# EAGLE design tempPCB (EAGLE 9.6.2)
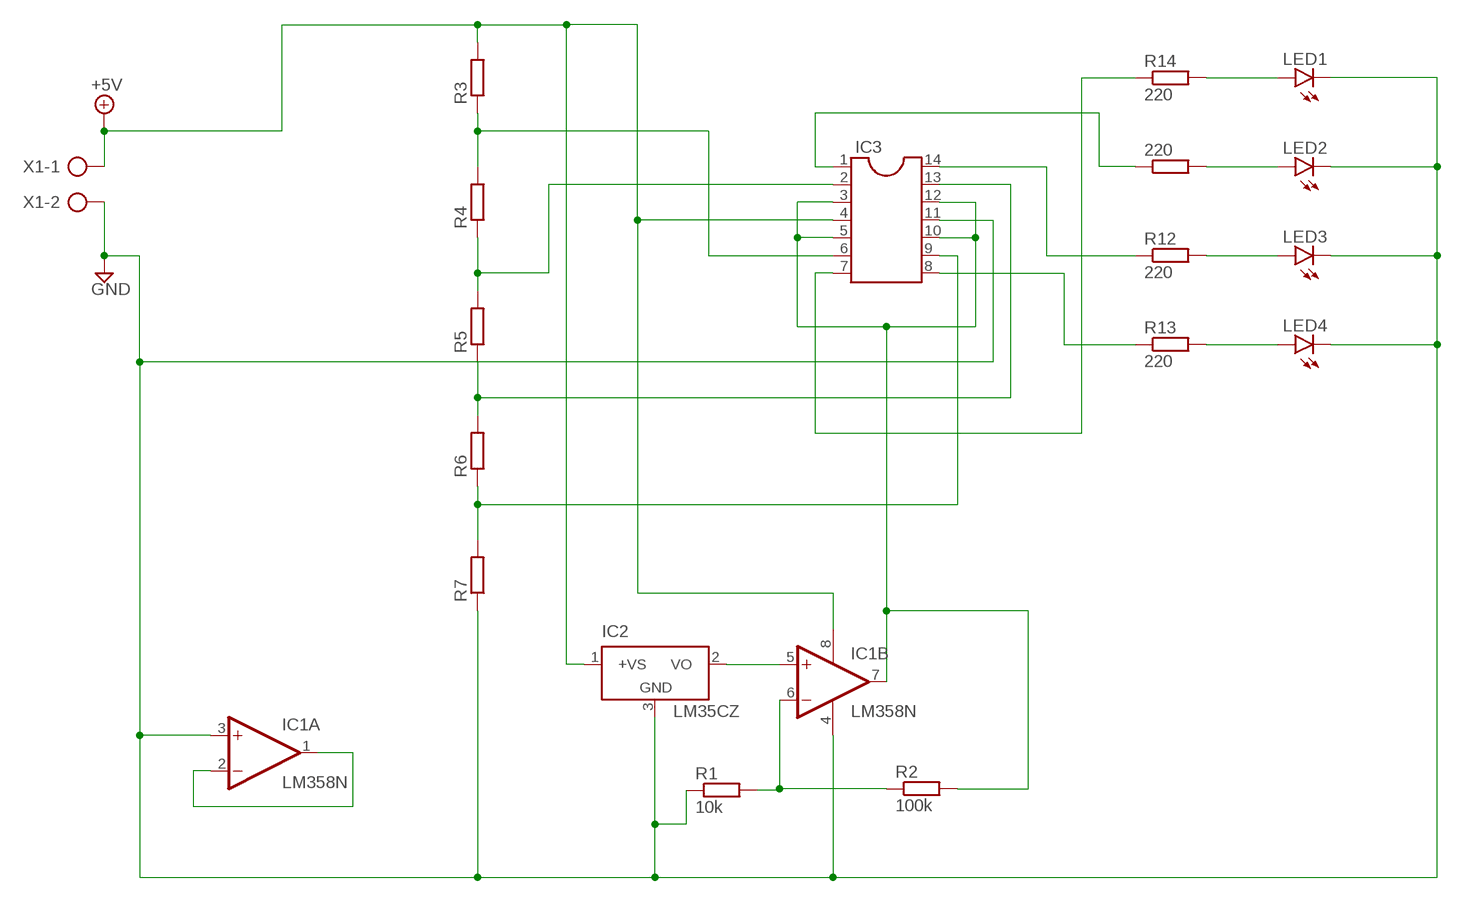
[diagram p0: schematic, sheet 1]

## Parts
220  R-EU_0207/10  [0207/10]
IC1  LM358N  [DIL08]
IC2  LM35CZ  [TO92]
IC3  DIL14  [DIL14]
LED1  LED5MM  [LED5MM]
LED2  LED5MM  [LED5MM]
LED3  LED5MM  [LED5MM]
LED4  LED5MM  [LED5MM]
R1  10k  R-EU_R1206  [R1206]
R2  100k  R-EU_R1206  [R1206]
R3  R-EU_R1206  [R1206]
R4  R-EU_0207/10  [0207/10]
R5  R-EU_R1206  [R1206]
R6  R-EU_0207/10  [0207/10]
R7  R-EU_R1206  [R1206]
R12  220  R-EU_0207/10  [0207/10]
R13  220  R-EU_0207/10  [0207/10]
R14  220  R-EU_0207/10  [0207/10]
X1  AK500/2  [AK500/2]

## Nets
+5V: IC1.8(P:V+) IC2.1(+VS) IC3.4 R3.2 X1.1
GND: IC1.3(A:+IN) IC1.4(P:V-) IC2.3(GND) IC3.11 LED1.K(C) LED2.K(C) LED3.K(C) LED4.K(C) R1.1 R7.1 X1.2
N$1: LED1.A R14.2
N$2: 220.2 LED2.A
N$3: LED3.A R12.2
N$4: LED4.A R13.2
N$5: IC1.1(A:OUT) IC1.2(A:-IN)
N$6: IC3.7 R14.1
N$7: 220.1 IC3.1
N$8: IC3.14 R12.1
N$9: IC3.8 R13.1
N$10: IC3.13 R5.1 R6.2
N$11: IC1.5(B:+IN) IC2.2(VO)
N$12: IC1.6(B:-IN) R1.2 R2.1
N$13: IC1.7(B:OUT) IC3.3 IC3.5 IC3.10 IC3.12 R2.2
N$14: IC3.9 R6.1 R7.2
N$15: IC3.2 R4.1 R5.2
N$20: IC3.6 R3.1 R4.2

## Library data of the parts
220 R1-R7 R12-R14 = rcl:R-EU_: RESISTOR, European symbol; SPICEPREFIX: R
IC1 = linear:LM358: OP AMP also LM158; LM258; LM2904 Source: http://cache.national.com/ds/LM/LM158.pdf
IC2 = lm35:LM35: Single-Supply Centigrade Temperature Sensor Vout = (10mV/°C x Temp °C) +5mmmV Source: http://www.national.com/ds/LM/LM35.pdf
IC3 = ic-package:DIL14: Dual In Line / Socket
LED1-LED4 = led:LED: LED OSRAM: - CHIPLED LG R971, LG N971, LY N971, LG Q971, LY Q971, LO R971, LY R971 LH N974, LH R974 LS Q976, LO Q976, LY Q976 LO Q996 - Hyper CHIPLED LW Q18S LB Q993, LB Q99A, LB R99A - SideLED LS A670, LO A670, LY A670, LG A670, LP A670 LB A673, LV A673, LT A673, LW A673 LH A674 LY A675 LS A676, LA A676, LO A676, LY A676, LW A676 LS A679, LY A679, LG A679 - Hyper Micro SIDELED® LS Y876, LA Y876, LO Y876, LY Y876 LT Y87S - SmartLED LW L88C, LW L88S LB L89C, LB L89S, LG L890 LS L89K, LO L89K, LY L89K LS L896, LA L896, LO L896, LY L896 - TOPLED LS T670, LO T670, LY T670, LG T670, LP T670 LSG T670, LSP T670, LSY T670, LOP T670, LYG T670 LG T671, LOG T671, LSG T671 LB T673, LV T673, LT T673, LW T673 LH T674 LS T676, LA T676, LO T676, LY T676, LB T676, LH T676, LSB T676, LW T676 LB T67C, LV T67C, LT T67C, LS T67K, LO T67K, LY T67K, LW E67C LS E67B, LA E67B, LO E67B, LY E67B, LB E67C, LV E67C, LT E67C LW T67C LS T679, LY T679, LG T679 LS T770, LO T770, LY T770, LG T770, LP T770 LB T773, LV T773, LT T773, LW T773 LH T774 LS E675, LA E675, LY E675, LS T675 LS T776, LA T776, LO T776, LY T776, LB T776 LHGB T686 LT T68C, LB T68C - Hyper Mini TOPLED® LB M676 - Mini TOPLED Santana® LG M470 LS M47K, LO M47K, LY M47K Source: http://www.osram.convergy.de LUXEON: - LUMILED® LXK2-PW12-R00, LXK2-PW12-S00, LXK2-PW14-U00, LXK2-PW14-V00 LXK2-PM12-R00, LXK2-PM12-S00, LXK2-PM14-U00 LXK2-PE12-Q00, LXK2-PE12-R00, LXK2-PE12-S00, LXK2-PE14-T00, LXK2-PE14-U00 LXK2-PB12-K00, LXK2-PB12-L00, LXK2-PB12-M00, LXK2-PB14-N00, LXK2-PB14-P00, LXK2-PB14-Q00 LXK2-PR12-L00, LXK2-PR12-M00, LXK2-PR14-Q00, LXK2-PR14-R00 LXK2-PD12-Q00, LXK2-PD12-R00, LXK2-PD12-S00 LXK2-PH12-R00, LXK2-PH12-S00 LXK2-PL12-P00, LXK2-PL12-Q00, LXK2-PL12-R00 Source: www.luxeon.com KINGBRIGHT: KA-3528ASYC Source: www.kingbright.com
X1 = con-ptr500:AK500/2: CONNECTOR; OC_FARNELL: unknown; OC_NEWARK: unknown

## Board
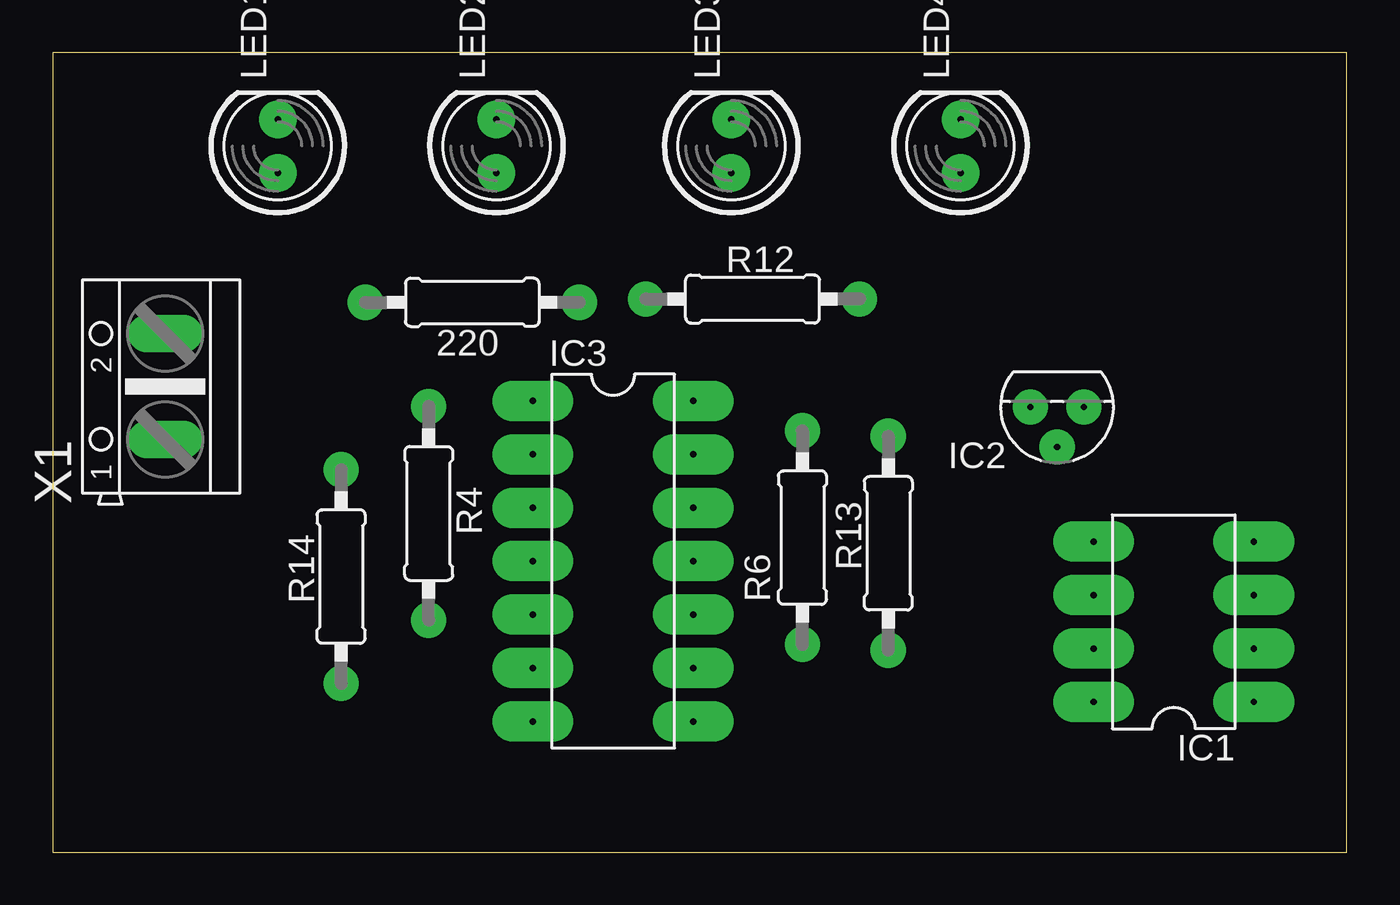
[diagram p1: board, top side]
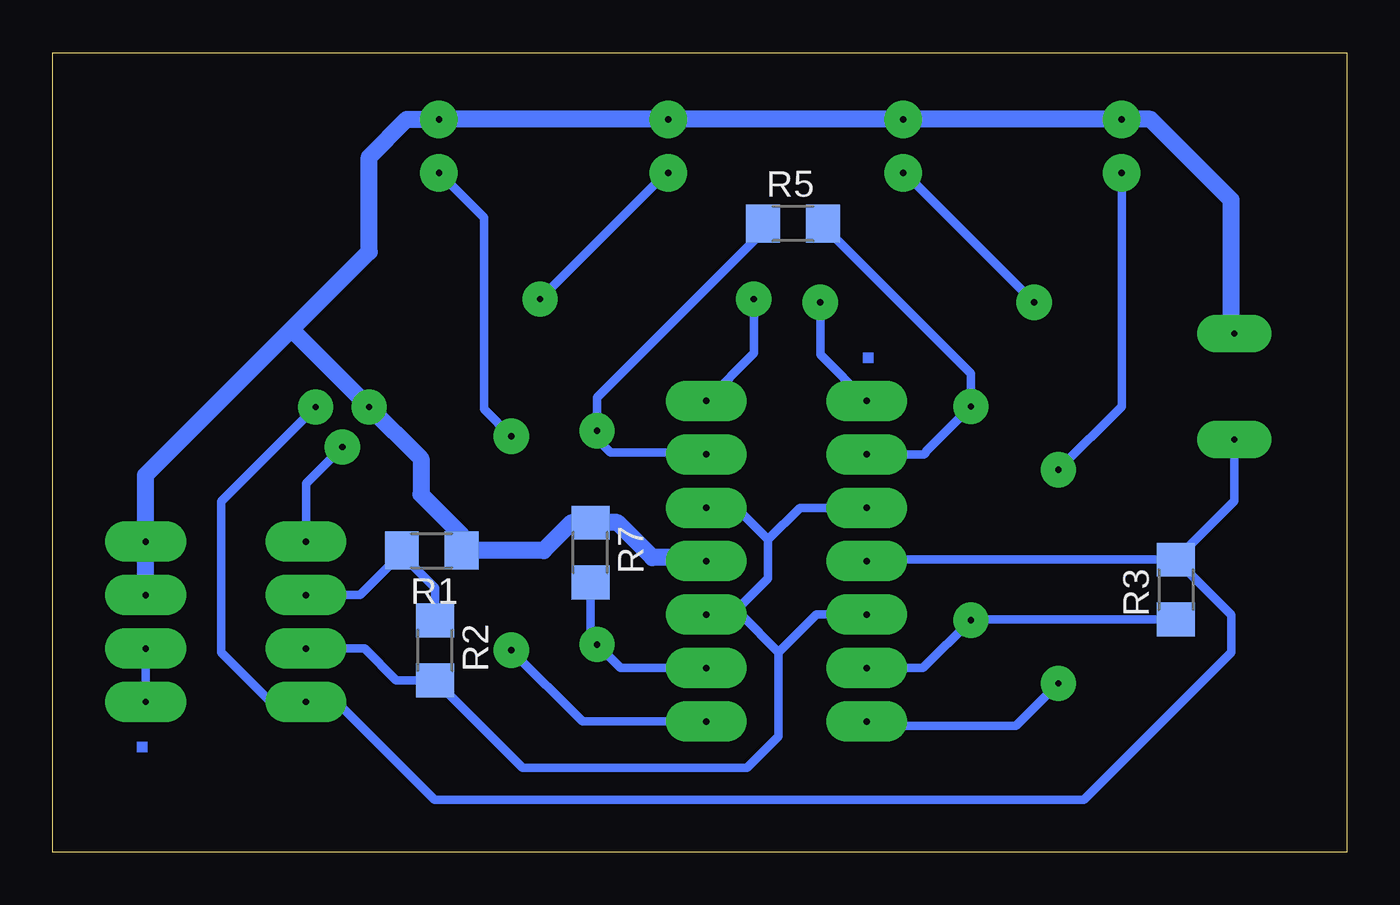
[diagram p2: board, bottom side, seen from below]

Size 61.5 x 38 mm. Coordinates in mm from the lower left corner, seen from the top.
Outline: 0,0 61.5,0 61.5,38 0,38 0,0
Copper layers (1*16): Top 0.035mm / dielectric 1.5mm / Bottom 0.035mm
Design rules "OpenLab": minimum track width 0.4mm, minimum drill 0.6mm, track to track 0.5mm, track to pad 0.5mm, pad to pad 0.5mm, via to via 0.5mm, smd to smd 0.1mm, copper to edge 2mm, drill to drill 0.2mm, minimum pad ring 10mil, minimum via ring 8mil, stop-mask expansion 4mil, vias tented up to drill 0mil, thermal gap 10mil

### Footprints (pad centres in the part's own frame; a part is rotated, then mirrored left to right if it is on the bottom)
0207/10 = drill 0.3 pad 1.676: 1 -5.08,0; 2 5.08,0
DIL08 = drill 0.3 pad 1.93 long: 1 -3.81,-3.81; 2 -1.27,-3.81; 3 1.27,-3.81; 4 3.81,-3.81; 5 3.81,3.81; 6 1.27,3.81; 7 -1.27,3.81; 8 -3.81,3.81
TO92 = drill 0.3 pad 1.676: 1 -1.27,0; 2 0,1.905; 3 1.27,0
DIL14 = drill 0.3 pad 1.93 long: 1 -7.62,-3.81; 2 -5.08,-3.81; 3 -2.54,-3.81; 4 0,-3.81; 5 2.54,-3.81; 6 5.08,-3.81; 7 7.62,-3.81; 8 7.62,3.81; 9 5.08,3.81; 10 2.54,3.81; 11 0,3.81; 12 -2.54,3.81; 13 -5.08,3.81; 14 -7.62,3.81
LED5MM = drill 0.3 pad 1.778: A -1.27,0; K 1.27,0
R1206 = smd 1.6 x 1.803: 1 -1.422,0; 2 1.422,0
AK500/2 = drill 0.3 pad 1.778 long: 1 -2.515,0; 2 2.515,0

### Placement (x,y rotation side)
220  19.94,26.13 180 top
IC1  53.27,10.95 90 top
IC2  47.73,21.16 180 top
IC3  26.63,13.83 270 top
LED1  10.7,33.56 90 top
LED2  21.09,33.56 90 top
LED3  32.25,33.56 90 top
LED4  43.14,33.56 90 top
R1  43.49,14.33 180 bottom
R2  43.33,9.59 270 bottom
R3  8.13,12.48 90 bottom
R4  17.87,16.1 270 top
R5  26.32,29.87 0 bottom
R6  35.63,14.95 90 top
R7  35.95,14.24 270 bottom
R12  33.26,26.29 0 top
R13  39.71,14.68 90 top
R14  13.71,13.1 90 top
X1  5.35,22.13 90 top

### Tracks (layer width: path | path; a pad name or v marks a point on that pad's centre or on a via)
+5V
  Bottom 0.406: R3.2 5.35,16.68 X1.1 | R3.2 22.75,13.9 IC3.4 | IC2.1 53.5,16.66 53.5,9.5 51.14,7.14 IC1.8 48,7.14 43.36,2.5 12.5,2.5 5.5,9.5 5.5,11.27 R3.2
GND
  Bottom 0.813: X1.2 5.5,24.8 5.5,31 9.33,34.83 LED1.K LED2.K LED3.K LED4.K 44.67,34.83 46.46,33.04 46.46,28.54 50.25,24.75 | 50.25,24.75 57.08,17.92 IC1.4 IC1.3 | 50.25,24.75 50.05,24.75 IC2.3 44,18.7 44,17 42.07,15.07 R1.1 38.17,14.33 36.84,15.66 R7.1 34.66,15.66 33,14 30.61,14 IC3.11
N$1
  Bottom 0.406: LED1.A 10.7,21.19 R14.2
N$2
  Bottom 0.406: 220.2 21.02,32.29 LED2.A
N$3
  Bottom 0.406: R12.2 32.34,32.29 LED3.A
N$4
  Bottom 0.4: 41.5,30.65 41,30.15 41,21.05 R13.2
  Bottom 0.406: LED4.A 41.5,30.65
N$5
  Bottom 0.406: IC1.2 IC1.1
N$6
  Bottom 0.406: R14.1 15.73,6 22.61,6 IC3.7
N$7
  Bottom 0.406: IC3.1 25.02,23.65 220.1
N$8
  Bottom 0.406: R12.1 28.18,23.71 IC3.14
N$9
  Bottom 0.4: IC3.8 36.32,6.21 R13.1
N$10
  Bottom 0.4: R5.1 27.74,29.49 27.87,29.37 | IC3.13 30.53,19 35,19 35.63,19.63 R6.2
  Bottom 0.406: 27.87,29.37 35.63,21.6 R6.2
N$11
  Bottom 0.406: IC1.5 49.46,17.52 IC2.2
N$12
  Bottom 0.4: R2.1 43.33,12.57 | R1.2 44.93,14.31 44.93,14.17
  Bottom 0.406: 43.33,12.57 44.93,14.17 46.88,12.22 IC1.6
N$13
  Bottom 0.4: IC3.12 29,16.37 27.5,14.87 | 39.16,4 28.5,4 27,5.5 27,9.5 | IC3.5 25.21,11.29 27,9.5 | 27.5,14.87 27.5,13 29.21,11.29 IC3.10 28.79,11.29 27,9.5 | 27.5,14.87 26,16.37 IC3.3 | R2.2 45.17,8.17 46.68,9.68 IC1.7
  Bottom 0.406: 39.16,4 R2.2
N$14
  Bottom 0.4: IC3.9 34.51,8.75 R6.1
  Bottom 0.406: R7.2 35.95,10.19 R6.1
N$15
  Bottom 0.4: R5.2 24.9,29.77 24.76,29.63 | R4.1 20,19.05 20,19 20.09,18.91 IC3.2
  Bottom 0.406: R4.1 17.87,22.74 24.76,29.63
N$20
  Bottom 0.4: R4.2 20.14,8.75 IC3.6
  Bottom 0.406: R3.1 17.83,11.06 R4.2

### Text on the board
Bottom: . | .